# EAGLE design Spresense Shield (EAGLE 9.5.2)
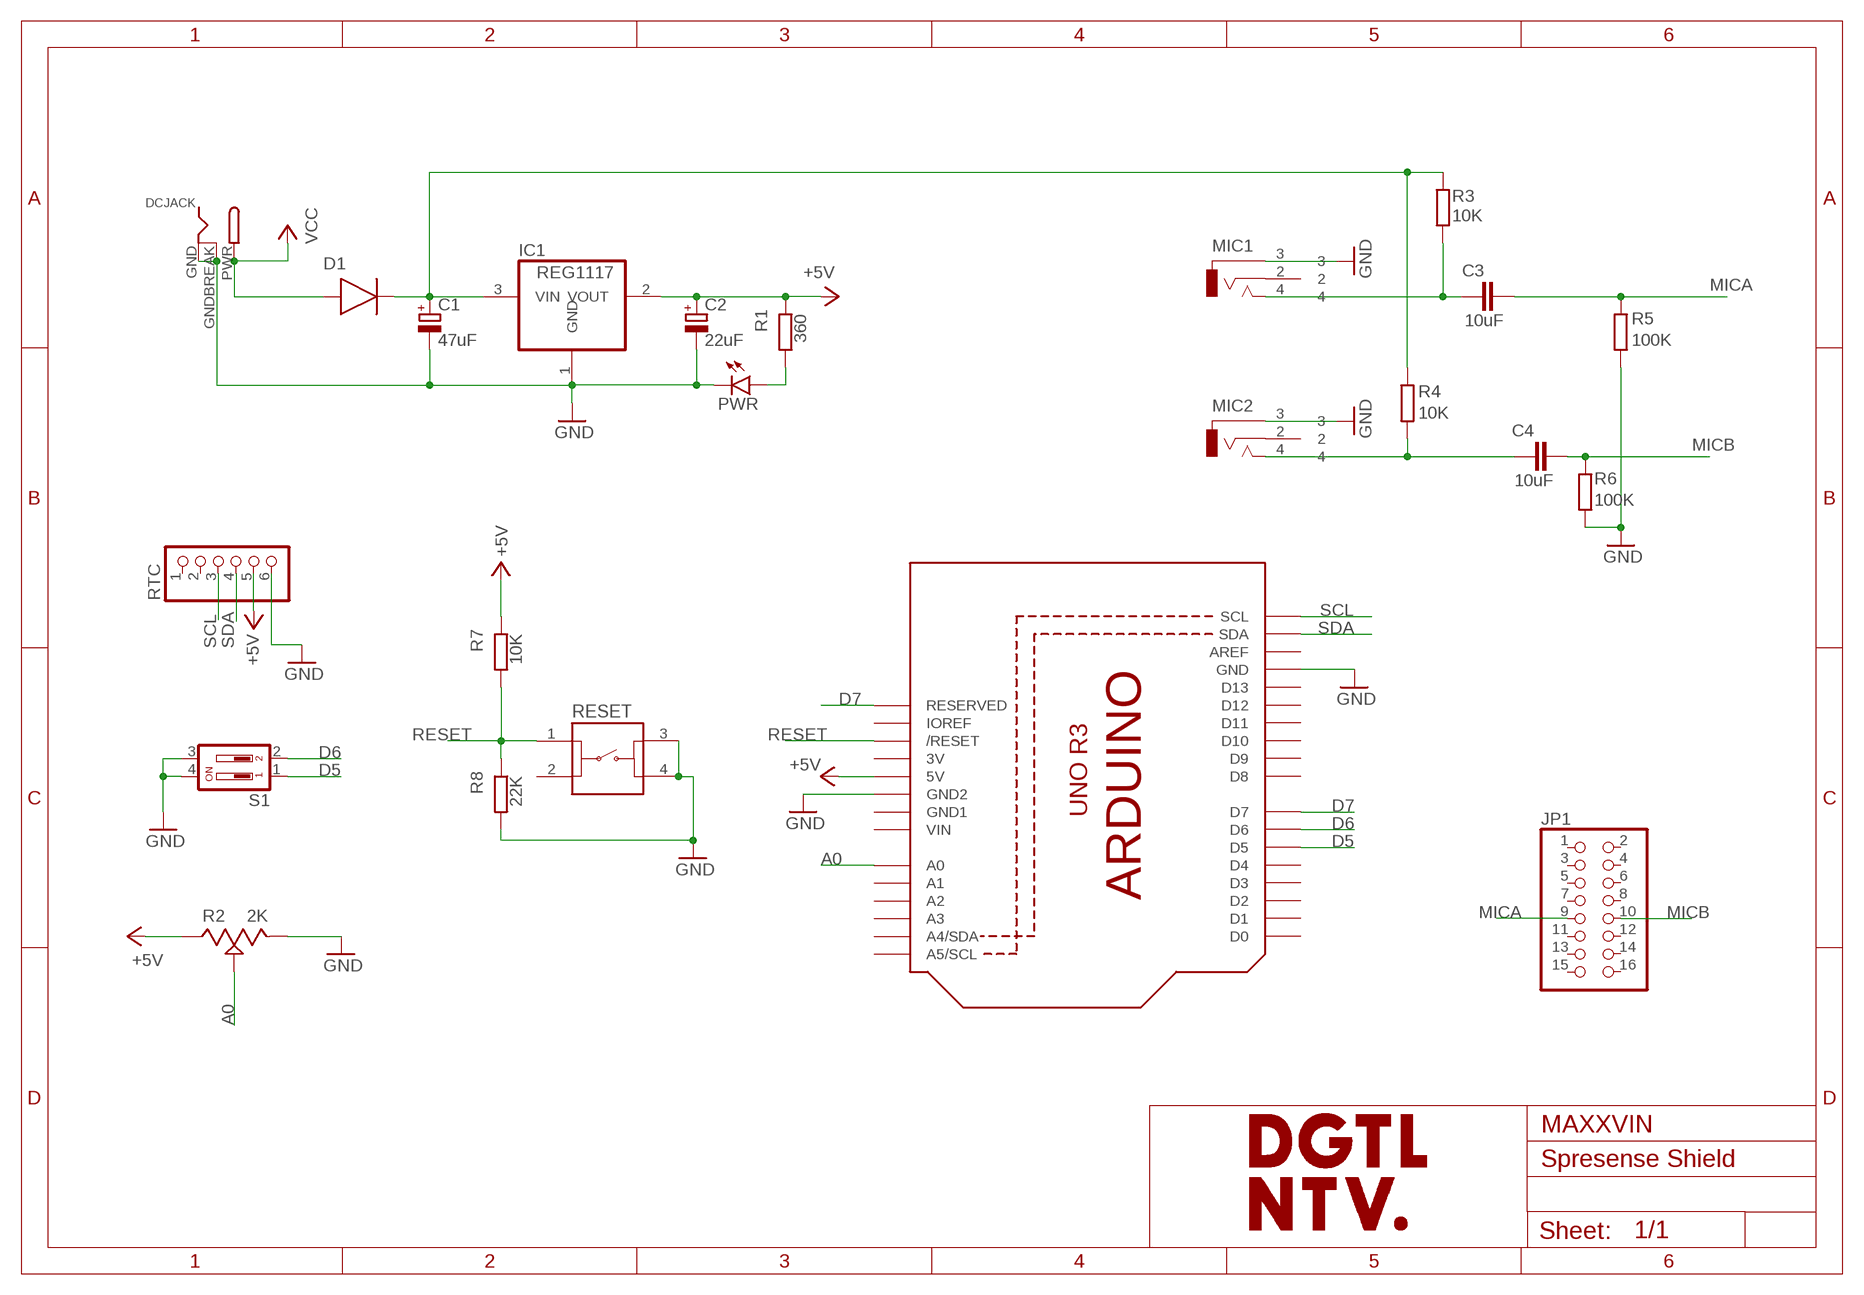
[diagram p0: schematic, sheet 1]

## Parts
C1  47uF  CPOL-EU153CLV-0605  [153CLV-0605]
C2  22uF  CPOL-EU153CLV-0605  [153CLV-0605]
C3  10uF  C_CHIP-0805(2012-METRIC)  [CAPC2012X110]
C4  10uF  C_CHIP-0805(2012-METRIC)  [CAPC2012X110]
D1  DIODEDO-214AC(SMA)  [DIOM5226X290N]
DCJACK  DCBARRELPTH  [DCJACK_2MM_PTH]
IC1  REG1117  [SOT223]
JP1  PINHD-2X8  [2X08]
MIC1  PJ-320F  [PJ-320F]
MIC2  PJ-320F  [PJ-320F]
PWR  LEDCHIP-LED0805  [CHIP-LED0805]
R1  360  R_CHIP-0805(2012-METRIC)  [RESC2012X65]
R2  2K  3362P-1-103LF  [3362P-1-103LF]
R3  10K  R_CHIP-0805(2012-METRIC)  [RESC2012X65]
R4  10K  R_CHIP-0805(2012-METRIC)  [RESC2012X65]
R5  100K  R_CHIP-0805(2012-METRIC)  [RESC2012X65]
R6  100K  R_CHIP-0805(2012-METRIC)  [RESC2012X65]
R7  10K  R_CHIP-0805(2012-METRIC)  [RESC2012X65]
R8  22K  R_CHIP-0805(2012-METRIC)  [RESC2012X65]
RESET  1825910-6  [1825910-6]
RTC  PINHD-1X6  [1X06]
S1  DS02  [DS-02]
U1  ARDUINOR3-DIMENSION  [ARDUINOR3]

## Nets
+5V: C2.+ IC1.2(VOUT) R1.1 R2.3 R7.1 RTC.5 U1.5V
A0: R2.2 U1.A0
D5: S1.1 U1.D5
D6: S1.2 U1.D6
D7: U1.D7 U1.RESERVED
GND: C1.- C2.- DCJACK.GND DCJACK.GNDBREAK IC1.1(GND) MIC1.3 MIC2.3 PWR.C R2.1 R5.2 R6.2 R8.2 RESET.3 RESET.4 RTC.6 S1.3 S1.4 U1.GND U1.GND2
MICA: C3.2 JP1.9 R5.1
MICB: C4.2 JP1.10 R6.1
N$1: C4.1 MIC2.4 R4.2
N$2: C1.+ D1.2(C) IC1.3(VIN) R3.1 R4.1
N$3: C3.1 MIC1.4 R3.2
N$4: PWR.A R1.2
RESET: R7.2 R8.1 RESET.1 U1.RESET(/RESET)
SCL: RTC.3 U1.SCL
SDA: RTC.4 U1.SDA
VCC: D1.1(A) DCJACK.PWR
Unconnected: JP1.1 JP1.2 JP1.3 JP1.4 JP1.5 JP1.6 JP1.7 JP1.8 JP1.11 JP1.12 JP1.13 JP1.14 JP1.15 JP1.16 MIC1.2 MIC2.2 RESET.2 RTC.1 RTC.2 U1.A1 U1.A2 U1.A3 U1.A4(A4/SDA) U1.A5(A5/SCL) U1.AREF U1.D0 U1.D1 U1.D2 U1.D3 U1.D4 U1.D8 U1.D9 U1.D10 U1.D11 U1.D12 U1.D13 U1.IOREF

## Notes on the sheet
- MAXXVIN

## Power pins joined to a net without a drawn wire
3V: U1.3V
GND1: U1.GND1
VIN: U1.VIN

## Library data of the parts
C1 C2 = rcl:CPOL-EU: POLARIZED CAPACITOR, European symbol; SPICEPREFIX: C
C3 C4 = Capacitor:C: Capacitor - Generic; CATEGORY: Capacitor
D1 = Diode:DIODE: Diode Rectifier - Generic; CATEGORY: Diode; SUB-CATEGORY: Rectifier
DCJACK = adafruit:DCBARREL: 2.0mm DC Barrel Jack DCJACK_2MM_PTH - Through Hole Jack (4UConnector: 05537)
IC1 = burr-brown:REG1117: 800mA and 1A Low Dropout (LDO) Positive Regulator 1.8V, 2.5V, 2.85V, 3.3V, 5V, and Adj; MPN: REG1117; OC_FARNELL: 1097566; OC_NEWARK: 14P6981
JP1 = Connector:PINHD-2X8: PIN HEADER; CATEGORY: CONNECTOR; SPICEPREFIX: X; SUB-CATEGORY: PIN-HEADER
MIC1 MIC2 = PJ-320F:PJ-320F: 3.5mm Audio Jack PJ-320f
PWR = led:LED: LED OSRAM: - CHIPLED LG R971, LG N971, LY N971, LG Q971, LY Q971, LO R971, LY R971 LH N974, LH R974 LS Q976, LO Q976, LY Q976 LO Q996 - Hyper CHIPLED LW Q18S LB Q993, LB Q99A, LB R99A - SideLED LS A670, LO A670, LY A670, LG A670, LP A670 LB A673, LV A673, LT A673, LW A673 LH A674 LY A675 LS A676, LA A676, LO A676, LY A676, LW A676 LS A679, LY A679, LG A679 - Hyper Micro SIDELED® LS Y876, LA Y876, LO Y876, LY Y876 LT Y87S - SmartLED LW L88C, LW L88S LB L89C, LB L89S, LG L890 LS L89K, LO L89K, LY L89K LS L896, LA L896, LO L896, LY L896 - TOPLED LS T670, LO T670, LY T670, LG T670, LP T670 LSG T670, LSP T670, LSY T670, LOP T670, LYG T670 LG T671, LOG T671, LSG T671 LB T673, LV T673, LT T673, LW T673 LH T674 LS T676, LA T676, LO T676, LY T676, LB T676, LH T676, LSB T676, LW T676 LB T67C, LV T67C, LT T67C, LS T67K, LO T67K, LY T67K, LW E67C LS E67B, LA E67B, LO E67B, LY E67B, LB E67C, LV E67C, LT E67C LW T67C LS T679, LY T679, LG T679 LS T770, LO T770, LY T770, LG T770, LP T770 LB T773, LV T773, LT T773, LW T773 LH T774 LS E675, LA E675, LY E675, LS T675 LS T776, LA T776, LO T776, LY T776, LB T776 LHGB T686 LT T68C, LB T68C - Hyper Mini TOPLED® LB M676 - Mini TOPLED Santana® LG M470 LS M47K, LO M47K, LY M47K Source: http://www.osram.convergy.de LUXEON: - LUMILED® LXK2-PW12-R00, LXK2-PW12-S00, LXK2-PW14-U00, LXK2-PW14-V00 LXK2-PM12-R00, LXK2-PM12-S00, LXK2-PM14-U00 LXK2-PE12-Q00, LXK2-PE12-R00, LXK2-PE12-S00, LXK2-PE14-T00, LXK2-PE14-U00 LXK2-PB12-K00, LXK2-PB12-L00, LXK2-PB12-M00, LXK2-PB14-N00, LXK2-PB14-P00, LXK2-PB14-Q00 LXK2-PR12-L00, LXK2-PR12-M00, LXK2-PR14-Q00, LXK2-PR14-R00 LXK2-PD12-Q00, LXK2-PD12-R00, LXK2-PD12-S00 LXK2-PH12-R00, LXK2-PH12-S00 LXK2-PL12-P00, LXK2-PL12-Q00, LXK2-PL12-R00 Source: www.luxeon.com KINGBRIGHT: KA-3528ASYC Source: www.kingbright.com
R1 R3-R8 = Resistor:R: Resistor Fixed - Generic; CATEGORY: Resistor; SUB-CATEGORY: Fixed
R2 = Potentiometer_Trimmers:3362P-1-103LF: TRIMMER 10K OHM 0.5W PC PIN TOP Manufacturer's datasheet <https://www.bourns.com/docs/Product-Datasheets/3362.pdf>; CREATED_PN: PCBLayout.com; DIGIKEY_PN: 3362P-103LF-ND; MANUFACTURER: Bourns Inc.; MPN: 3362P-1-103LF
RESET = Switch:1825910-6: SWITCH TACTILE SPST-NO 0.05A 24V Manufacturer's datasheet <https://www.te.com/commerce/DocumentDelivery/DDEController?Action=srchrtrv&DocNm=1825910&DocType=Customer+Drawing&DocLang=English>; CREATED_BY: PCBLayout.com; DIGIKEY_PART_NUMBER: 450-1650-ND; MANUFACTURER: TE Connectivity ALCOSWITCH Switches; MPN: 1825910-6
RTC = Connector:PINHD-1X6: PIN HEADER; CATEGORY: CONNECTOR; SUB-CATEGORY: PIN-HEADER
S1 = Switch:DS02: DIL/CODE SWITCH; CATEGORY: SWITCH; MPN: MCNDS02; TYPE: SPST
U1 = adafruit:ARDUINOR3: This is a new object for the new Arduino R3 - with extra pins that you may want to use (such as IOref, and duplicated A4/A5

## Board
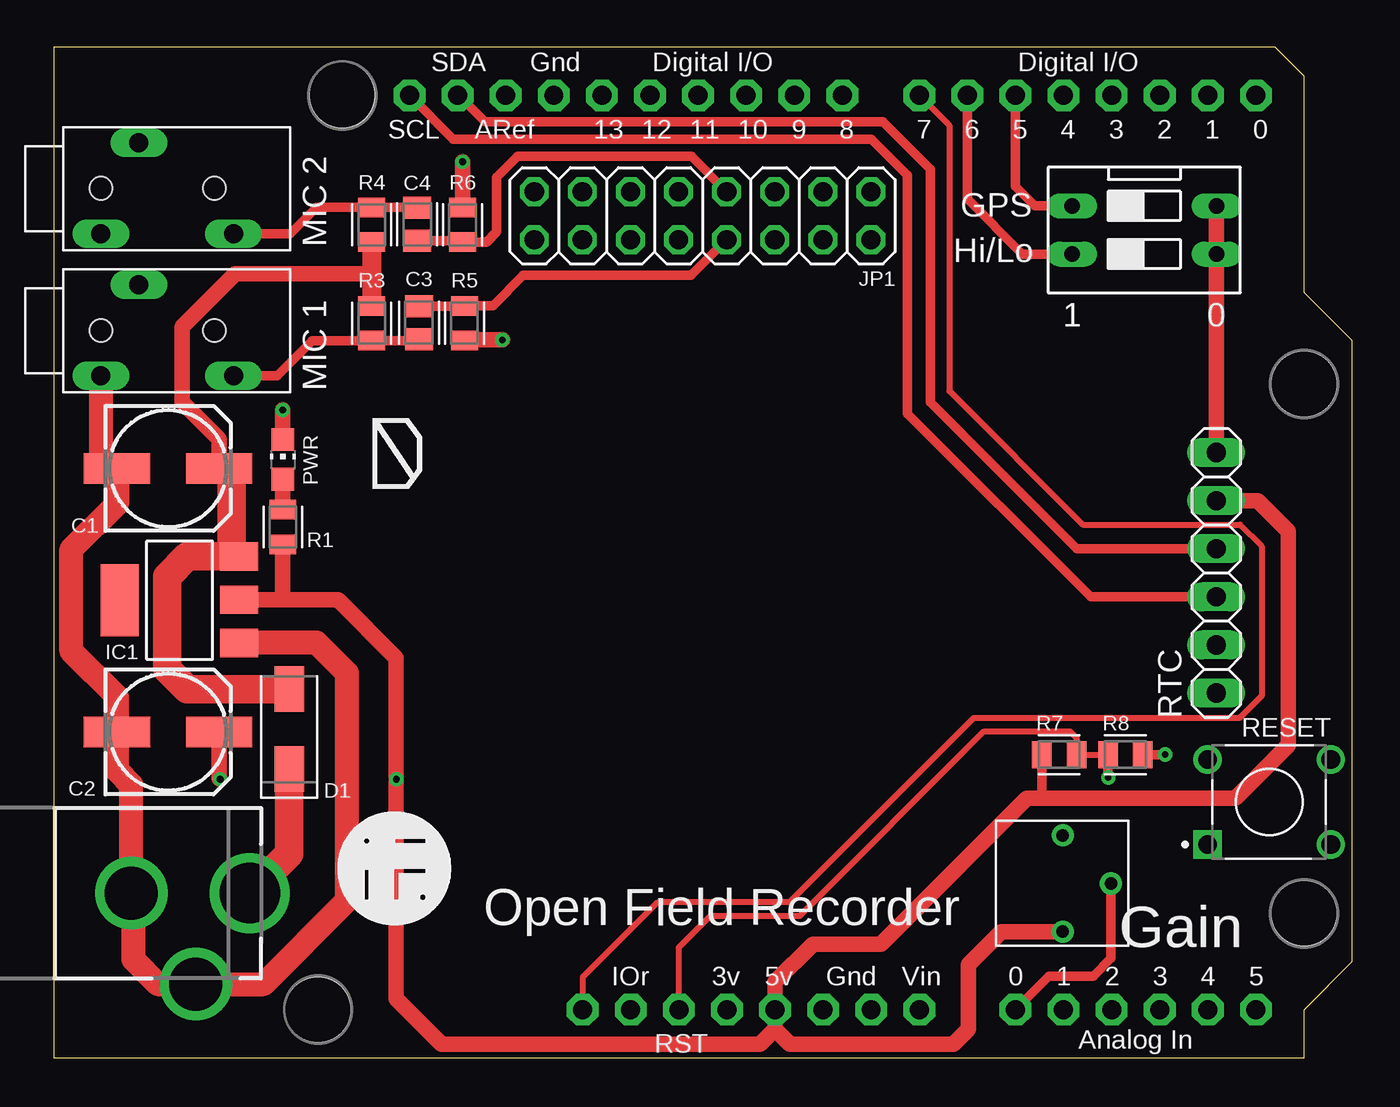
[diagram p1: board, top side]
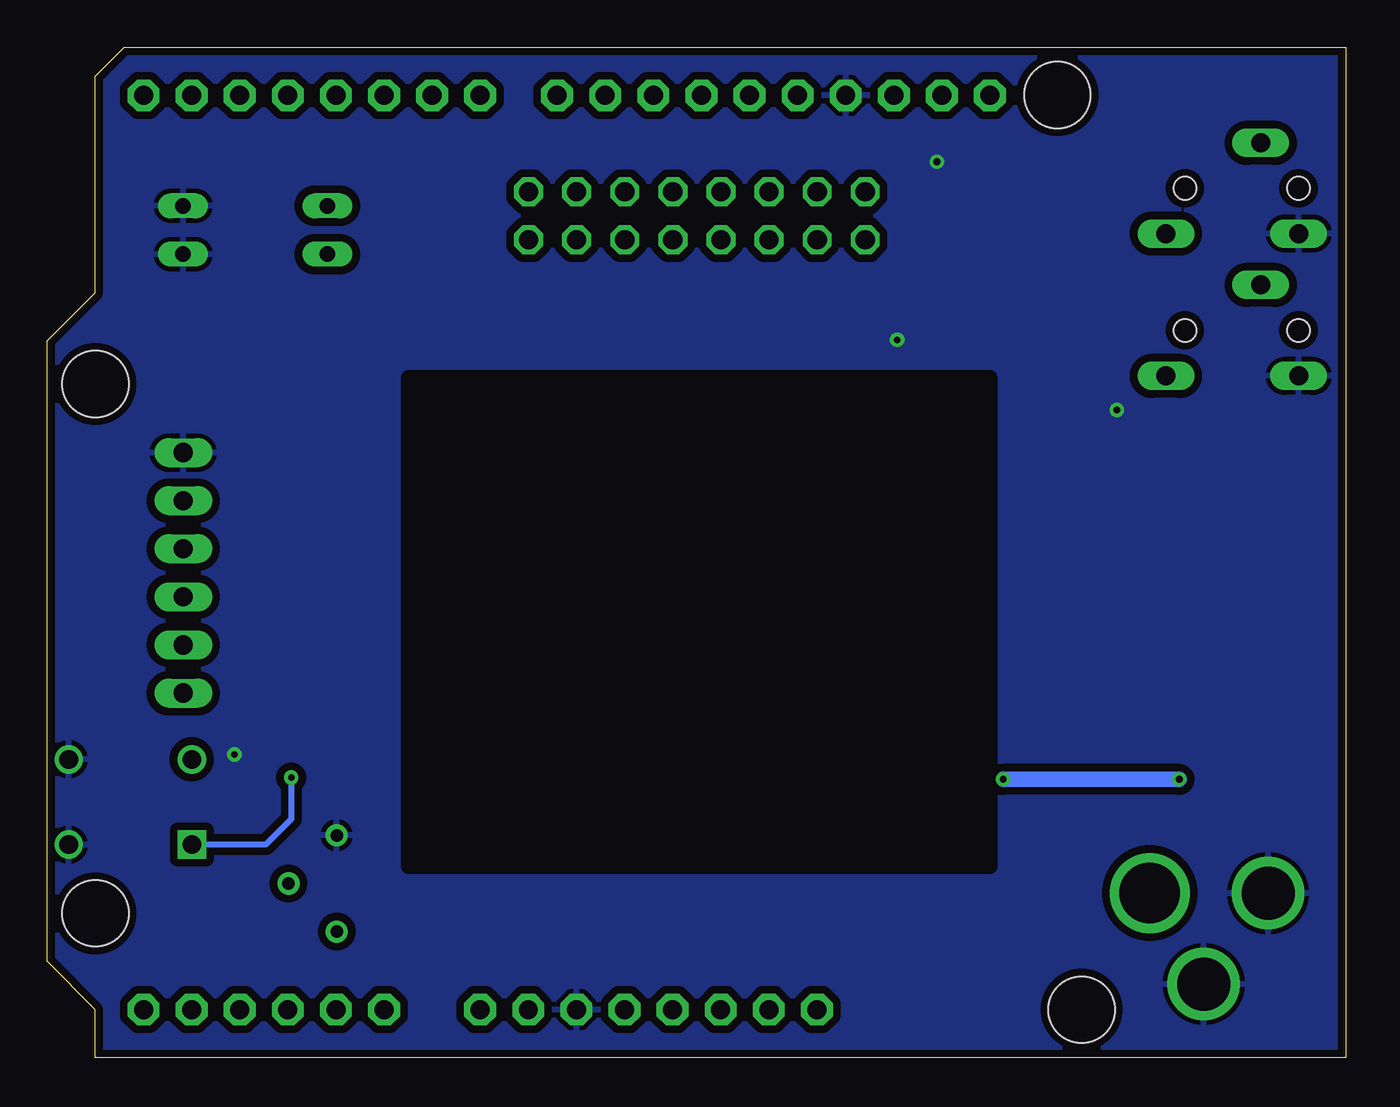
[diagram p2: board, bottom side, seen from below]

Size 68.58 x 53.34 mm. Coordinates in mm from the lower left corner, seen from the top.
Copper layers (1*16): Top 0.035mm / dielectric 1.5mm / Bottom 0.035mm
Design rules "default *": minimum track width 6mil, minimum drill 0.35mm, track to track 12mil, track to pad 12mil, pad to pad 12mil, via to via 12mil, smd to smd 4mil, copper to edge 12mil, drill to drill 12mil, minimum pad ring 10mil, minimum via ring 8mil, stop-mask expansion 4mil, vias tented up to drill 0mil, thermal gap 10mil
Holes 3.5 mm at 15.24,50.82 66.04,35.57 66.04,7.62 13.96,2.54
bRestrict: area 18.8,10.1 to 49.5,35.9

### Footprints (pad centres in the part's own frame; a part is rotated, then mirrored left to right if it is on the bottom)
153CLV-0605 = smd 3.5 x 1.6: + 2.7,0; - -2.7,0
CAPC2012X110 = smd 1.165 x 1.465: 1 -0.875,0; 2 0.875,0
DIOM5226X290N = smd 2.392 x 1.565: 1 -2.108,0; 2 2.108,0
DCJACK_2MM_PTH = drill 2.8: GND 0,7.35; GNDBREAK 4.8,10.75 | drill 3.2: PWR 0,13.6
SOT223 = smd 1.499 x 2.007: 1 -2.261,-3.15; 2 0.025,-3.15; 3 2.311,-3.15 | smd 3.81 x 2.007: 4 0,3.15
2X08 = drill 1.016 octagon: 1 -8.89,-1.27; 2 -8.89,1.27; 3 -6.35,-1.27; 4 -6.35,1.27; 5 -3.81,-1.27; 6 -3.81,1.27; 7 -1.27,-1.27; 8 -1.27,1.27; 9 1.27,-1.27; 10 1.27,1.27; 11 3.81,-1.27; 12 3.81,1.27; 13 6.35,-1.27; 14 6.35,1.27; 15 8.89,-1.27; 16 8.89,1.27
PJ-320F = drill 1 long: 2 -1.5,2.3; 3 -3.5,-2.5; 4 3.5,-2.5 | hole 1.2: -3.5,-0.1; 2.5,-0.1
CHIP-LED0805 = smd 1.2 x 1.2: A 0,-1.05; C 0,1.05
RESC2012X65 = smd 1.031 x 1.42: 1 -0.919,0; 2 0.919,0
3362P-1-103LF = drill 0.66: 1 -2.54,0; 2 0,2.54; 3 2.54,0
1825910-6 = drill 0.99 square: 1 3.25,2.25 | drill 0.99: 2 3.25,-2.25; 3 -3.25,2.25; 4 -3.25,-2.25
1X06 = drill 1.016 long: 1 -6.35,0; 2 -3.81,0; 3 -1.27,0; 4 1.27,0; 5 3.81,0; 6 6.35,0
DS-02 = drill 0.813 long: 1 -1.27,-3.81; 2 1.27,-3.81; 3 1.27,3.81; 4 -1.27,3.81
ARDUINOR3 = drill 1 pad 1.676 octagon: 3V 35.56,2.54; 5V 38.1,2.54; A0 50.8,2.54; A1 53.34,2.54; A2 55.88,2.54; A3 58.42,2.54; A4 60.96,2.54; A5 63.5,2.54; AREF 23.876,50.8; D0 63.5,50.8; D1 60.96,50.8; D2 58.42,50.8; D3 55.88,50.8; D4 53.34,50.8; D5 50.8,50.8; D6 48.26,50.8; D7 45.72,50.8; D8 41.656,50.8; D9 39.116,50.8; D10 36.576,50.8; D11 34.036,50.8; D12 31.496,50.8; D13 28.956,50.8; GND 26.416,50.8; GND1 43.18,2.54; GND2 40.64,2.54; IOREF 30.48,2.54; RESERVED 27.94,2.54; RESET 33.02,2.54; SCL 18.796,50.8; SDA 21.336,50.8; VIN 45.72,2.54

### Placement (x,y rotation side)
C1  6.05,31.11 0 top
C2  6.05,17.2 0 top
C3  19.3,38.8 90 top
C4  19.2,44 270 top
D1  12.45,17.35 90 top
DCJACK  -3.24,8.69 270 top
IC1  6.65,24.15 90 top
JP1  34.27,44.45 0 top
MIC1  6,38.5 0 top
MIC2  6,46 0 top
PWR  12.11,31.59 0 top
R1  12.11,28.02 90 top
R2  53.3,9.2 270 top
R3  16.8,38.78 270 top
R4  16.8,43.98 90 top
R5  21.7,38.78 270 top
R6  21.6,43.98 90 top
R7  53.1,16 0 top
R8  56.6,16 0 top
RESET  64.2,13.5 180 top
RTC  61.4,25.6 90 top
S1  57.6,43.7 270 top
U1  0,0 0 top
U$1  [IF_SOLID_LOGO_TOP_6MM]  15,7 0 top
U$4  [D_LOGO_TOP_2.7MM]  16.8,30 0 top

### Tracks (layer width: path | path; a pad name or v marks a point on that pad's centre or on a via)
+5V  (via drill 0.35)
  Top 0.508: R7.1 52.18,13.72 52.2,13.7
  Top 0.813: 38.1,1.51 U1.5V 38.1,4 40.1,6 43.7,6 51.4,13.7 52.2,13.7 62.4,13.7 65.2,16.5 65.2,27.8 63.59,29.41 RTC.5 | R2.3 50.06,6.66 48.3,4.9 48.3,1.5 47.51,0.71 38.9,0.71 38.1,1.51 | IC1.2 12.1,24.18 | 12.1,24.18 15.03,24.18 18.1,21.1 v18.1,14.7 18.1,3.1 20.49,0.71 37.3,0.71 38.1,1.51 | 12.1,24.18 12.11,24.18 R1.1 | C2.+ 8.75,14.75 v8.8,14.7
  Bottom 0.813: v8.8,14.7 v18.1,14.7
A0
  Top 0.508: U1.A0 52.56,4.3 54.9,4.3 55.84,5.24 R2.2
D5
  Top 0.508: S1.1 51.83,44.97 50.8,46 U1.D5
D6
  Top 0.508: S1.2 51.17,42.43 48.26,45.34 U1.D6
D7
  Top 0.305: U1.D7 47.3,49.22 47.3,35.2 54.36,28.14 62.66,28.14 63.8,27 63.8,19.1 62.63,17.93 48.59,17.93 38.85,8.2 31.9,8.2 27.94,4.24 U1.RESERVED
GND  (via drill 0.35)
  Top 0.508: R8.2 v58.7,16
  Top 0.813: S1.4 S1.3 61.38,42.4 61.4,42.38 RTC.6 61.45,32 | MIC1.3 1.8,36 | 2.01,43.5 MIC2.3 3.4,43.5 | U1.GND 26.4,50.82 | PWR.C v12.1,34.2 | R6.2 v21.6,47.3 | R5.2 21.74,37.9 v23.7,37.9
  Top 1.27: IC1.1 9.78,21.91 13.89,21.91 15.5,20.3 15.5,8.3 11.09,3.89 DCJACK.GNDBREAK 5.51,3.89 4.21,5.19 4.21,8.59 DCJACK.GND 4.11,14.39 3.35,15.15 C2.- 3.35,19.05 0.94,21.46 0.94,26.84 3.35,29.25 C1.- 2.5,31.11 MIC1.3
  pour Bottom (isolate 0.406): 0,53.4 64.6,53.4 66.1,51.9 66.1,40.4 68.6,37.9 68.6,5.1 66.1,2.6 66.1,0 0,0 0,13.2
MICA
  Top 0.508: C3.2 21.68,39.67 R5.1 23.2,39.7 24.8,41.3 33.66,41.3 JP1.9
MICB
  Top 0.508: C4.2 21.53,43.12 R6.1 22.86,43.06 23.4,43.6 23.4,46.49 24.5,47.59 29.2,47.59 33.68,47.59 JP1.10
N$1
  Top 0.508: MIC2.4 12.5,43.5 13.9,44.9 R4.2 19.18,44.9 C4.1
N$2
  Top 0.813: C1.+ 8.75,32.65 6.8,34.6 6.8,38.6 9.6,41.4 16.8,41.4
  Top 1.016: R4.1 16.8,41.4 R3.1
  Top 1.27: 9.84,26.5 IC1.3
  Top 1.508: D1.2 7.04,19.46 6,20.5 6,25.4 7.06,26.46 9.4,26.46 | 9.4,26.46 IC1.3 | C1.+ 9.4,31.11 9.4,26.46
N$3
  Top 0.508: MIC1.4 11.8,36 13.66,37.86 R3.2 19.23,37.86 C3.1
N$4
  Top 0.813: R1.2 PWR.A
RESET  (via drill 0.35)
  Top 0.305: R8.1 R7.2 54.02,16.88 53.68,17.22 49.14,17.22 39.41,7.49 34.69,7.49 33.02,5.82 U1.RESET
  Top 0.508: R8.1 55.68,14.81 v55.7,14.79
  Bottom 0.305: v55.7,14.79 55.7,12.6 57.05,11.25 RESET.1
SCL
  Top 0.508: U1.SCL 21.1,48.5 43.2,48.5 45.1,46.6 45.1,34 54.77,24.33 RTC.3
SDA
  Top 0.508: U1.SDA 21.4,50.8 22.8,49.4 43.8,49.4 46.3,46.9 46.3,34.6 54.03,26.87 RTC.4
VCC
  Top 1.508: DCJACK.PWR 12.45,10.78 D1.1

### Text on the board
tNames: GPS | MIC 2 | Hi/Lo | 1 | 0 | MIC 1 | Gain | Open Field Recorder